# Altium schematic sheet [5]Current_Sensor.SchDoc
size A4; SheetNumber: 7; SheetTotal: 7
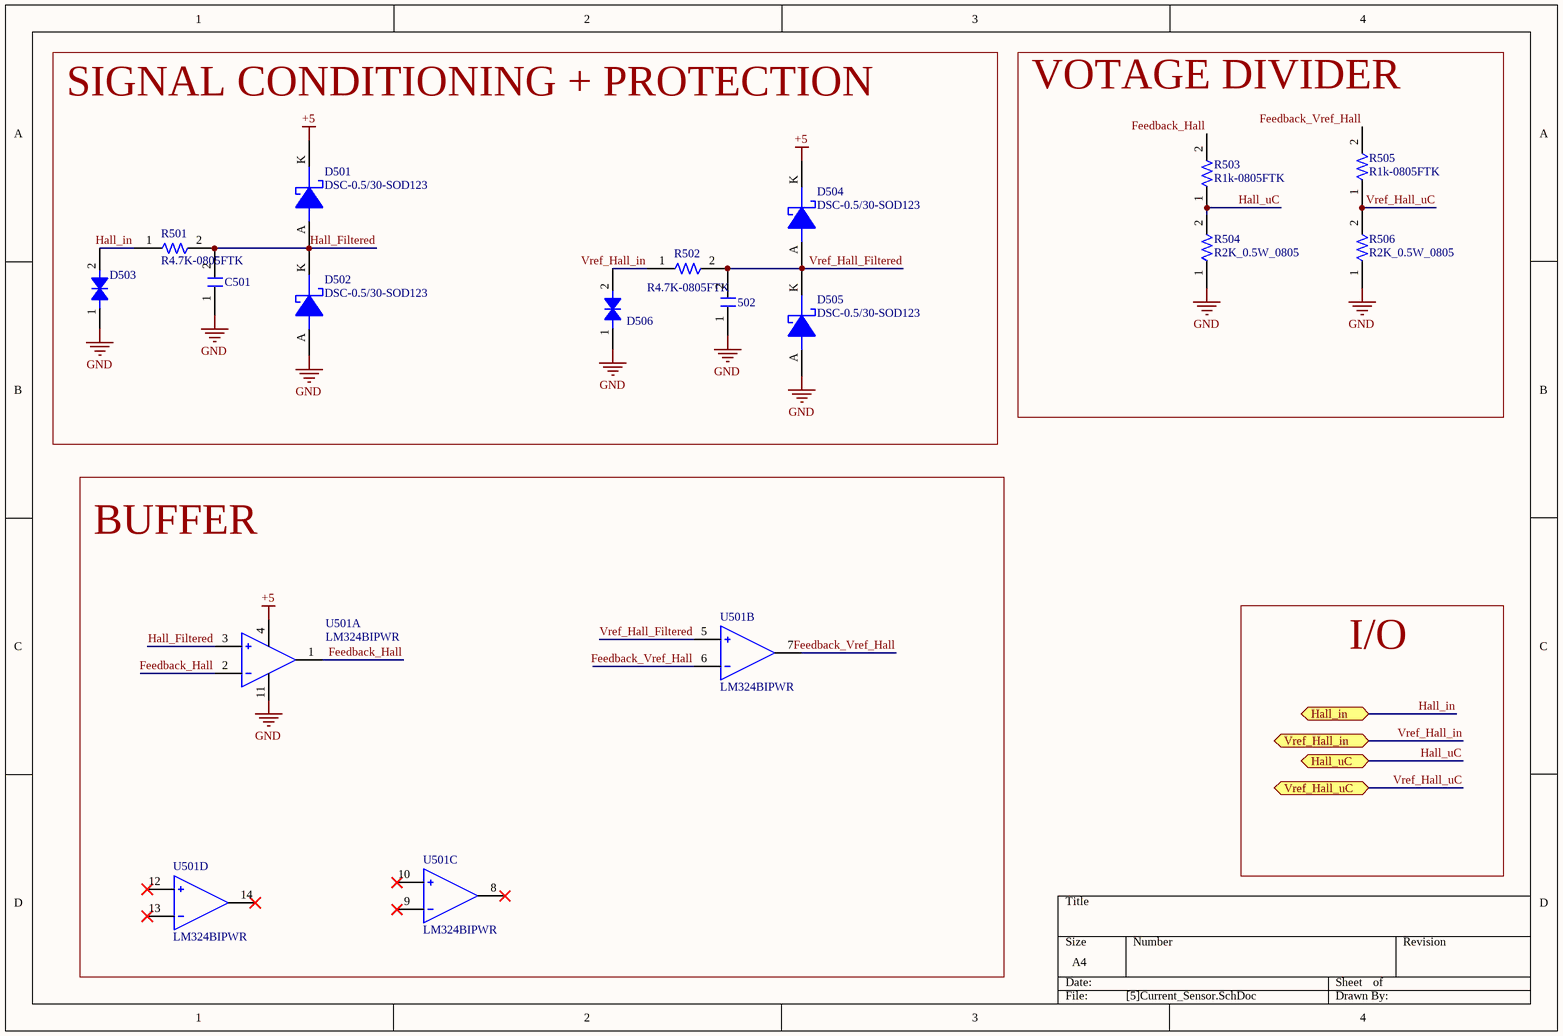
[diagram p0: [5]Current_Sensor.SchDoc]

## Parts
502  C10n-50V-0805FNPC-X7R  [C0805FNPC-R]  (value not drawn)
C501  C10n-50V-0805FNPC-X7R  [C0805FNPC-R]  (value not drawn)
D501  DSC-0.5/30-SOD123  [DSC-SOD123]
D502  DSC-0.5/30-SOD123  [DSC-SOD123]
D503  DTVS-6V-DO-214AC  [DTVS-DO-214AC]  (value not drawn)
D504  DSC-0.5/30-SOD123  [DSC-SOD123]
D505  DSC-0.5/30-SOD123  [DSC-SOD123]
D506  DTVS-6V-DO-214AC  [DTVS-DO-214AC]  (value not drawn)
R501  R4.7K-0805FTK  [R0805FTK]
R502  R4.7K-0805FTK  [R0805FTK]
R503  R1k-0805FTK  [R0805FTK]
R504  R2K_0.5W_0805  [0805]
R505  R1k-0805FTK  [R0805FTK]
R506  R2K_0.5W_0805  [0805]
U501  LM324BIPWR  [FP-PW0014A-IPC_B]  (parts A,B,C,D of 4)

## Blocks framed on the sheet
SIGNAL CONDITIONING + PROTECTION: 502 C501 D501-D506 R501 R502
VOTAGE DIVIDER: R503-R506
BUFFER: U501

## Ports
Hall_in (bidir, see Master_HV_PCB[2A]), Hall_uC (bidir, see Master_HV_PCB[2A]), Vref_Hall_in (bidir, see Master_HV_PCB[2A]), Vref_Hall_uC (bidir, see Master_HV_PCB[2A])

## Nets
+5: D501.K D504.K U501.4(VCC+)
GND: 502.1 C501.1 D502.A D503.1 D505.A D506.1 R504.1 R506.1 U501.11(VCC-)
Feedback_Hall: R503.2 U501.1(1OUT) U501.2(1IN-)
Feedback_Vref_Hall: R505.2 U501.6(2IN-) U501.7(2OUT)
Hall_Filtered: C501.2 D501.A D502.K R501.2 U501.3(1IN+)
Hall_in: D503.2 R501.1 ; port Hall_in
Hall_uC: R503.1 R504.2 ; port Hall_uC
Vref_Hall_Filtered: 502.2 D504.A D505.K R502.2 U501.5(2IN+)
Vref_Hall_in: D506.2 R502.1 ; port Vref_Hall_in
Vref_Hall_uC: R505.1 R506.2 ; port Vref_Hall_uC

Not connected (* = marked no-connect by the designer): U501 8(3OUT)* 9(3IN-)* 10(3IN+)* 12(4IN+)* 13(4IN-)* 14(4OUT)*

## Notes on the sheet
- I/O

## Library data of the parts
502 C501 = CMP-00053-1: Cap, 0.01ΜF, 50V, 10%, X7R, 0805; Manufacturer Part Number 1: 885012207092; Manufacturer 1: Wurth Electronics; .Creator: DR; Value: 10nF; ComponentLink4URL: https://katalog.we-online.de/pbs/datasheet/885012207092.pdf?src-supplier=Digi-Key; Width: 0.049inch; ComponentLink1URL: http://www.farnell.com/datasheets/1958497.pdf?src-supplier=Farnell; Max Operating Temperature: 125°C; Packaging: Cut Tape; Mount: Surface Mount; ComponentLink2Description: http://www.farnell.com/datasheets/1958497.pdf?src-supplier=Element14; Voltage Rating: 50V; Source: Passives.SchLib; Design Item ID: C10n-50V-0805FNPC-X7R; ComponentLink4Description: https://katalog.we-online.de/pbs/datasheet/885012207092.pdf?src-supplier=Digi-Key; Stock 1: 1; Tolerance: 10%; REACH SVHC: Unknown; ComponentLink2URL: http://www.farnell.com/datasheets/1958497.pdf?src-supplier=Element14; ComponentLink1Description: http://www.farnell.com/datasheets/1958497.pdf?src-supplier=Farnell; RoHS: Yes; Min Operating Temperature: -55°C; Voltage Rating (DC): 50V; Dielectric: X7R; ComponentLink3URL: http://www.farnell.com/datasheets/1958497.pdf?src-supplier=Newark; Category: Ceramic Capacitors; ComponentLink3Description: http://www.farnell.com/datasheets/1958497.pdf?src-supplier=Newark; Case/Package: 0805; Pricing 1: 4000=0,03200, 12000=0,03100 (USD); Length: 0.079inch; RoHS Compliant: Yes; Case Code (Metric): 2012; Thickness: 0.035inch
D501 D502 D504 D505 = CMP-00165-1: VR=30V IF=500mA 30pF P=410mW; Max Reverse Leakage Current: 130uA; .Creator: GP; Max Reverse Voltage (DC): 30V; Element Configuration: Single; Average Rectified Current: 500mA; Peak Non-Repetitive Surge Current: 5.5A; Polarity: Standard; Forward Voltage: 430mV; ComponentLink10Description: https://datasheet.ciiva.com/910/mbr0530-910518.pdf?src-supplier=Digi-Key; ComponentLink1Description: Datasheet; Category: Diode; ComponentLink3Description: https://datasheet.ciiva.com/30479/0900766b810e2512-30479401.pdf?src-supplier=RSComponents; ComponentLink5Description: https://datasheet.ciiva.com/910/mbr0530-910516.pdf?src-supplier=Digi-Key; Stock 1: 9; Weight: 0.03g; Source: Filter components.SchLib; ComponentLink2Description: Where buy it; Series: -; Mount: Surface Mount; Max Repetitive Reverse Voltage (Vrrm): 30V; Pricing 1: 1=0,34400, 10=0,23900, 100=0,12200, 500=0,10000 (USD); Design Item ID: DSC-0.5/30-SOD123; ComponentLink8Description: https://datasheet.ciiva.com/17318/mbr0530-17318568.pdf?src-supplier=Future+Electronics; Current Rating: 500mA; ComponentLink1URL: *; Length: 2.7mm; Max Reverse Current: 130uA; ComponentLink7URL: https://datasheet.ciiva.com/8300/mbr0530-8300905.pdf?src-supplier=Avnet; ComponentLink9URL: https://datasheet.ciiva.com/15144/getdatasheetpartid-86760-15144598.pdf?src-supplier=Verical; Radiation Hardening: No; Height: 1.03mm; ComponentLink4Description: https://datasheet.ciiva.com/34301/974753-34301826.pdf?src-supplier=Jameco; ComponentLink7Description: https://datasheet.ciiva.com/8300/mbr0530-8300905.pdf?src-supplier=Avnet; Package Quantity: 1; Forward Current: 500mA; ComponentLink5URL: https://datasheet.ciiva.com/910/mbr0530-910516.pdf?src-supplier=Digi-Key; Max Surge Current: 5.5A; Lead Free: Lead Free; ComponentLink2URL: *; Max Forward Surge Current (Ifsm): 5.5A; Output Current: 500mA; Voltage Rating (DC): 30V; Contact Plating: Tin,Matte; RoHS Compliant: Yes; REACH SVHC: No SVHC; ComponentLink10URL: https://datasheet.ciiva.com/910/mbr0530-910518.pdf?src-supplier=Digi-Key; ComponentLink4URL: https://datasheet.ciiva.com/34301/974753-34301826.pdf?src-supplier=Jameco; ComponentLink6URL: https://datasheet.ciiva.com/25931/mbr0530-25931989.pdf?src-supplier=Avnet+Europe; ComponentLink6Description: https://datasheet.ciiva.com/25931/mbr0530-25931989.pdf?src-supplier=Avnet+Europe; Width: 1.6mm; ComponentLink3URL: https://datasheet.ciiva.com/30479/0900766b810e2512-30479401.pdf?src-supplier=RSComponents; ComponentLink9Description: https://datasheet.ciiva.com/15144/getdatasheetpartid-86760-15144598.pdf?src-supplier=Verical; ComponentLink8URL: https://datasheet.ciiva.com/17318/mbr0530-17318568.pdf?src-supplier=Future+Electronics
D503 D506 = CMP-00154-1: TVS diode [Würth Elektronik] 824501600 TVS diode; Manufacturer: Wurth Electronics; Power Line Protection: No; Forward Voltage: 7.02V; Number of Bidirectional Channels: 1; Peak Pulse Current: 38.8A; Reverse Standoff Voltage: 6V; .Creator: DO; Polarity: Bidirectional; Peak Pulse Power: 400W; Clamping Voltage: 10.3V; ComponentLink2Description: http://www.farnell.com/datasheets/2036401.pdf?src-supplier=Element14; Source: Filter components.SchLib; ComponentLink3URL: https://katalog.we-online.de/pbs/datasheet/824501600.pdf?src-supplier=Digi-Key; Mount: Surface Mount; Design Item ID: DTVS-6V-DO-214AC; ComponentLink3Description: https://katalog.we-online.de/pbs/datasheet/824501600.pdf?src-supplier=Digi-Key; RoHS: Yes; Resistor Type: Zener; REACH SVHC: Unknown; Pins: 2; Min Breakdown Voltage: 7.02V; Min Operating Temperature: -65°C; ComponentLink1URL: https://www.we-online.com/catalog/en/WE-TVSP?sq=824501600#824501600; Stock 1: 780; Pricing 1: 1=0,28000, 10=0,26100, 50=0,26100, 100=0,23400, 500=0,20400, 1000=0,17400, 10000=0,17400 (USD); ComponentLink2URL: http://www.farnell.com/datasheets/2036401.pdf?src-supplier=Element14; Category: TVS Diodes; ComponentLink1Description: Where buy it; Manufacturer Part Number: 824501600; Packaging: Cut Tape; RoHS Compliant: Yes; Max Operating Temperature: 150°C
R501 R502 = CMP-00102-1: Res Thick Film 0805 4.7K Ohm 5% 1/8W ±200ppm/°C Molded SMD SMD Paper Tape on Plastic Reel; Manufacturer Part Number 1: CR0805-JW-472ELF; Manufacturer 1: Bourns; Max Power Dissipation: 125mW; .Creator: DR; Voltage Rating (DC): 150V; ComponentLink5URL: https://datasheet.ciiva.com/9122/chpreztr-9122814.pdf?src-supplier=Avnet; ComponentLink2URL: https://datasheet.ciiva.com/6560/chpreztr-6560073.pdf?src-supplier=Digi-Key; Depth: 1.25mm; ComponentLink7URL: https://datasheet.ciiva.com/6560/chpreztr-6560075.pdf?src-supplier=Digi-Key; Radiation Hardening: No; ComponentLink5Description: https://datasheet.ciiva.com/9122/chpreztr-9122814.pdf?src-supplier=Avnet; Construction: Rectangular; Case/Package: 0805; Design Item ID: R4.7K-0805FTK; RoHS Compliant: Yes; Min Operating Temperature: -55°C; Height: 0.024inch; ComponentLink1Description: https://datasheet.ciiva.com/5541/chpreztr-5541593.pdf?src-supplier=Mouser; Series: CR0805; Packaging: Tape and Reel; Width: 0.049inch; Stock 1: 3734; ComponentLink3URL: https://datasheet.ciiva.com/6560/chpreztr-6560074.pdf?src-supplier=Digi-Key; ComponentLink4URL: https://datasheet.ciiva.com/30174/159chpreztr-30174252.pdf?src-supplier=Onlinecomponents.com; Value: 4.7k; Military Standard: Not; Tolerance: 5%; Voltage Rating: 150V; ComponentLink6Description: https://datasheet.ciiva.com/22713/691949-22713272.pdf?src-supplier=Element14; REACH SVHC: No SVHC; Package Quantity: 1; Termination: SMD/SMT; ComponentLink1URL: https://datasheet.ciiva.com/5541/chpreztr-5541593.pdf?src-supplier=Mouser; ComponentLink4Description: https://datasheet.ciiva.com/30174/159chpreztr-30174252.pdf?src-supplier=Onlinecomponents.com; Resistor Type: Thick Film; Length: 2mm; Case Code (Metric): 2012; Category: Chip SMD Resistors; Resistance Tolerance: 5%; Thickness: 508um; ComponentLink6URL: https://datasheet.ciiva.com/22713/691949-22713272.pdf?src-supplier=Element14; Features: Moisture Resistant; Power Rating: 125mW; RoHS: Yes; Mount: Surface Mount; ComponentLink7Description: https://datasheet.ciiva.com/6560/chpreztr-6560075.pdf?src-supplier=Digi-Key; Number of Terminations: 2; Source: Passives.SchLib; Temperature Coefficient: 200ppm/°C; Max Operating Temperature: 155°C; ComponentLink3Description: https://datasheet.ciiva.com/6560/chpreztr-6560074.pdf?src-supplier=Digi-Key; ComponentLink2Description: https://datasheet.ciiva.com/6560/chpreztr-6560073.pdf?src-supplier=Digi-Key; Pricing 1: 1=0,05590, 10=0,01670, 25=0,01290, 100=0,00840, 250=0,00830, 500=0,00690, 1000=0,00410 (USD); Contact Plating: Tin
R503 R505 = CMP-00076-1: Res Thick Film 0805 1K Ohm 5% 1/8W ±200ppm/°C Molded SMD SMD Paper Tape on Plastic Reel; Manufacturer Part Number 1: CR0805-JW-102ELF; Manufacturer 1: Bourns; Voltage Rating (DC): 150V; Power Rating: 125mW; .Creator: GP; Number of Terminations: 2; REACH SVHC: No SVHC; ComponentLink3URL: https://datasheet.ciiva.com/22693/1902866-22693253.pdf?src-supplier=Element14; ComponentLink1URL: https://datasheet.ciiva.com/11821/0900766b80fcdb72-11821134.pdf?src-supplier=RSComponents; ComponentLink1Description: https://datasheet.ciiva.com/11821/0900766b80fcdb72-11821134.pdf?src-supplier=RSComponents; Category: Chip SMD Resistors; Stock 1: 27510; Case/Package: 0805; ComponentLink3Description: https://datasheet.ciiva.com/22693/1902866-22693253.pdf?src-supplier=Element14; Length: 2mm; ComponentLink5URL: https://datasheet.ciiva.com/7985/1856384-7985867.pdf?src-supplier=Element14; ComponentLink7Description: https://datasheet.ciiva.com/6547/chpreztr-6547359.pdf?src-supplier=Digi-Key; Package Quantity: 1; Tolerance: 5%; Lead Free: Lead Free; RoHS: Yes; Contact Plating: Tin; ComponentLink2Description: https://datasheet.ciiva.com/15225/getdatasheetpartid-78155-15225381.pdf?src-supplier=Verical; ComponentLink5Description: https://datasheet.ciiva.com/7985/1856384-7985867.pdf?src-supplier=Element14; Depth: 1.25mm; Thickness: 508um; Resistor Type: Thick Film; Design Item ID: R1k-0805FTK; ComponentLink2URL: https://datasheet.ciiva.com/15225/getdatasheetpartid-78155-15225381.pdf?src-supplier=Verical; Max Operating Temperature: 155°C; ComponentLink6URL: https://datasheet.ciiva.com/30242/159chpreztr-30242765.pdf?src-supplier=Onlinecomponents.com; ComponentLink4URL: https://datasheet.ciiva.com/7986/1856384-7986184.pdf?src-supplier=Element14; Military Standard: Not; Case Code (Metric): 2012; Temperature Coefficient: 200ppm/°C; Pricing 1: 1=0,05930, 10=0,03510, 25=0,01790, 100=0,00800, 250=0,00790, 500=0,00590, 1000=0,00360, 3000=0,00350, 6000=0,00250 (USD); Min Operating Temperature: -55°C; ComponentLink7URL: https://datasheet.ciiva.com/6547/chpreztr-6547359.pdf?src-supplier=Digi-Key; Width: 1.25mm; Source: Passives.SchLib; Max Power Dissipation: 125mW; Voltage Rating: 150V; ComponentLink4Description: https://datasheet.ciiva.com/7986/1856384-7986184.pdf?src-supplier=Element14; Features: Moisture Resistant; Mount: Surface Mount; Termination: SMD/SMT; Value: 1k; Height: 0.5mm; Radiation Hardening: No; ComponentLink6Description: https://datasheet.ciiva.com/30242/159chpreztr-30242765.pdf?src-supplier=Onlinecomponents.com; Pins: 2; Packaging: Tape and Reel
R504 R506 = CMP-009-00027-1: Fixed Resistor, Metal Glaze/thick Film, 0.5W, 2000ohm, 150V, 1% +/-Tol, 100ppm/Cel, Surface Mount, 0805; Part Number: CRCW08052K00FKEAHP; Manufacturer: Vishay; Value: 2k; Power: 500mW; Max Operating Temperature: 155°C; Case/Package: 0805; Mounting Technology: Surface Mount; RoHS Compliant: Yes; Tolerance: 1%; Min Operating Temperature: -55°C; Pins: 2
U501 = CMP-014-00004-4: Quad, 36-V 1.2-MHz 3-mV offset voltage operational amplifier with -40°C to 85°C operation 14-TSSOP -40 to 85